# Altium project ProjectX.PrjPcb
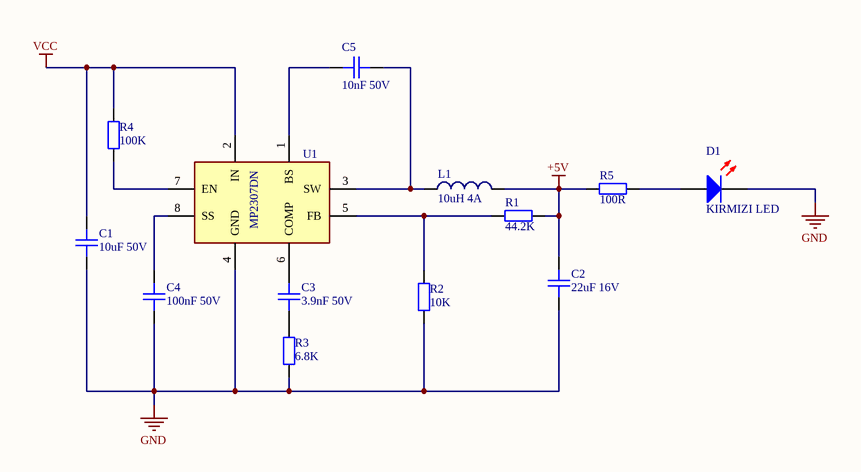
[diagram p0: MP2307DN.SchDoc]
3 sheets, 46 parts. Net scope: global (net labels, ports and power ports of the same name join across sheets).
Sheets:
  MP2307DN.SchDoc
  IR2101.SchDoc
  MCU.SchDoc

## Sheet MP2307DN.SchDoc
size A4

### Parts
C1  Deger: 10uF 50V  [CAP 1206/3216]  (hidden comment: CAP CER 10UF 50V X5R 1206)
C2  Deger: 22uF 16V  [CAP 1206/3216]  (hidden comment: CAP CERAMIC 22UF 16V X7S 20% PAD)
C3  Deger: 3.9nF 50V  [CAP 0805/2012]  (hidden comment: CAP CER 3900PF 50V X7R 0805)
C4  Deger: 100nF 50V  [CAP 0805/2012]  (hidden comment: CAP CER 0.1UF 50V X7R 0805)
C5  Deger: 10nF 50V  [CAP 0805/2012]  (hidden comment: CAP CER 10000PF 50V X7R 0805)
D1  Deger: KIRMIZI LED  [SMD: LED 0805/2012 RED]  (hidden comment: Red 645nm LED Indication - Discrete 1.8V 0805)
L1  FIXED IND 10UH 4A 68 MOHM SMD  [ASPI-0630LR-100M-T15]  (value not drawn)
R1  Deger: 44.2K  [RES_0805]  (hidden comment: RES SMD 44.2K OHM 1% 1/8W 0805)
R2  Deger: 10K  [RES_0805]  (hidden comment: RES SMD 10K OHM 1% 1/8W 0805)
R3  Deger: 6.8K  [RES_0805]  (hidden comment: RES SMD 6.8K OHM 1% 1/8W 0805)
R4  Deger: 100K  [RES_0805]  (hidden comment: RES SMD 100K OHM 1% 1/8W 0805)
R5  Deger: 100R  [RES_0805]  (hidden comment: RES SMD 100 OHM 1% 1/8W 0805)
U1  IC REG BUCK ADJUSTABLE 3A 8SOIC  [SOIC8_PAD]  (value not drawn)

### Nets
+5V: C2.2 L1.2 R1.2 R5.1
GND: C1.1 C2.1 C4.1 D1.2(K) R2.1 R3.1 U1.4(GND)
VCC: C1.2 R4.2 U1.2(IN)
NetC3_1: C3.1 R3.2
NetC3_2: C3.2 U1.6(COMP)
NetC4_2: C4.2 U1.8(SS)
NetC5_1: C5.1 U1.1(BS)
NetC5_2: C5.2 L1.1 U1.3(SW)
NetD1_1: D1.1(A) R5.2
NetR1_1: R1.1 R2.2 U1.5(FB)
NetR4_1: R4.1 U1.7(EN)

### Library data of the parts
C1 = 10uF 50V 1206: 10µF ±10% 50V Ceramic Capacitor X5R 1206 (3216 Metric); Cins: Kondansator; Uretici Kodu: CL31A106KBHNNNE; Kılıf: 1206; -Sicaklik: -55; +Sicaklik: +125; Lehim Yöntemi: SMD; MSL: 1 (Unlimited)
C2 = 22uF 16V 1206: 22µF ±20% 16V Ceramic Capacitor X7S 1206 (3216 Metric); Cins: Kondansator; Uretici Kodu: GRM31CC71C226ME11L; Kılıf: 1206; -Sicaklik: -55; +Sicaklik: +125; Lehim Yöntemi: SMD; MSL: 1 (Unlimited)
C3 = 3.9nF 50V 0805: 3900pF ±10% 50V Ceramic Capacitor X7R 0805 (2012 Metric); Cins: Kondansator; Uretici Kodu: CL21B392KBANNNC; Kılıf: 0805; -Sicaklik: -55; +Sicaklik: +125; Lehim Yöntemi: SMD; MSL: 1 (Unlimited)
C4 = 100nF 50V 0805: 0.1µF ±10% 50V Ceramic Capacitor X7R 0805 (2012 Metric); Kılıf: 0805; Cins: Kondansator; Uretici Kodu: CL21B104KBCNNNC; -Sicaklik: -55; +Sicaklik: +125; Lehim Yöntemi: SMD; MSL: 1 (Unlimited)
C5 = 10nF 50V 0805: 10000pF ±10% 50V Ceramic Capacitor X7R 0805 (2012 Metric); Cins: Kondansator; Uretici Kodu: CL21B103KBANNNC; Kılıf: 0805; -Sicaklik: -55; +Sicaklik: +125; Lehim Yöntemi: SMD; MSL: 1 (Unlimited)
D1 = LED_Kırmızı: LED RED DIFFUSED 0805 SMD; Uretici Kodu: LH R974-LP-1; Kılıf: 0805; -Sicaklik: -40; +Sicaklik: +125; Cins: LED; Lehim Yöntemi: SMD; MSL: 1 (Unlimited)
L1 = 10uH 4A: 10µH Shielded Molded Inductor 4A 68mOhm Max Nonstandard; Cins: Bobin; -Sicaklik: -55; +Sicaklik: +125; Uretici Kodu: ASPI-0630LR-100M-T15; Kılıf: Nonstandard; Lehim Yöntemi: SMD; MSL: 1 (Unlimited); Deger: 10uH 4A
R1 = 44.2K 0805: 44.2 kOhms ±1% 0.125W, 1/8W Chip Resistor 0805 (2012 Metric) Moisture Resistant Thick Film; Cins: Direnc; Uretici Kodu: RC0805FR-0744K2L; Kılıf: 0805; -Sicaklik: -55; +Sicaklik: +155; Lehim Yöntemi: SMD; MSL: 1 (Unlimited)
R2 = 10K 0805: 10 kOhms ±1% 0.125W, 1/8W Chip Resistor 0805 (2012 Metric) Moisture Resistant Thick Film; Cins: Direnc; Kılıf: 0805; Uretici Kodu: RC0805FR-0710KL; -Sicaklik: -55; +Sicaklik: +155; Lehim Yöntemi: SMD; MSL: 1 (Unlimited)
R3 = 6.8K 0805: 6.8 kOhms ±1% 0.125W, 1/8W Chip Resistor 0805 (2012 Metric) Moisture Resistant Thick Film; Cins: Direnc; Kılıf: 0805; Uretici Kodu: RC0805FR-076K8L; -Sicaklik: -55; +Sicaklik: +155; Lehim Yöntemi: SMD; MSL: 1 (Unlimited)
R4 = 100K 0805: 100 kOhms ±1% 0.125W, 1/8W Chip Resistor 0805 (2012 Metric) Moisture Resistant Thick Film; Cins: Direnc; Uretici Kodu: RC0805FR-07100KL; Kılıf: 0805; -Sicaklik: -55; +Sicaklik: +155; Lehim Yöntemi: SMD; MSL: 1 (Unlimited)
R5 = 100R 0805: 100 Ohms ±1% 0.125W, 1/8W Chip Resistor 0805 (2012 Metric) Moisture Resistant Thick Film; Cins: Direnc; Uretici Kodu: RC0805FR-07100RL; Kılıf: 0805; -Sicaklik: -55; +Sicaklik: +155; Lehim Yöntemi: SMD; MSL: 1 (Unlimited)
U1 = MP2307DN: Buck Switching Regulator IC Positive Adjustable 0.925V 1 Output 3A 8-SOIC (0.154", 3.90mm Width) Exposed Pad; Uretici Kodu: MP2307DN-LF-Z; -Sicaklik: -40; +Sicaklik: +85; Lehim Yöntemi: SMD; Cins: IC; Kılıf: 8-SOIC; MSL: 2A (4 Weeks); Deger: MP2307DN

## Sheet IR2101.SchDoc
size A4
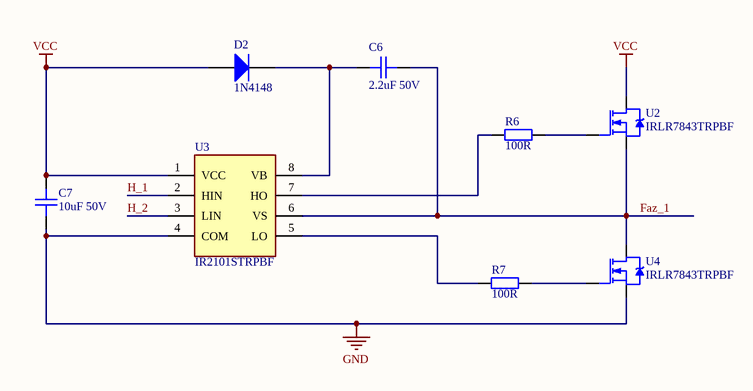
[diagram p1: IR2101.SchDoc]

### Parts
C6  Deger: 2.2uF 50V  [CAP 1206/3216]  (hidden comment: CAP CER 2.2UF 50V X5R 1206)
C7  Deger: 10uF 50V  [CAP 1206/3216]  (hidden comment: CAP CER 10UF 50V X5R 1206)
D2  1N4148 Diyot  [SOD-123]  (value not drawn)
R6  Deger: 100R  [RES_0805]  (hidden comment: RES SMD 100 OHM 1% 1/8W 0805)
R7  Deger: 100R  [RES_0805]  (hidden comment: RES SMD 100 OHM 1% 1/8W 0805)
U2  Deger: IRLR7843TRPBF  [DPAK]  (hidden comment: MOSFET N-CH 30V 161A DPAK)
U3  Deger: IR2101STRPBF  [SOIC8]  (hidden comment: IC GATE DRVR HALF-BRIDGE 8SOIC)
U4  Deger: IRLR7843TRPBF  [DPAK]  (hidden comment: MOSFET N-CH 30V 161A DPAK)

### Nets
GND: C7.1 U3.4(COM) U4.3(S)
VCC: C7.2 D2.1(A) U2.4(D) U3.1(VCC)
Faz_1: C6.1 U2.3(S) U3.6(VS) U4.4(D)
H_1: U3.2(HIN)
H_2: U3.3(LIN)
NetC6_2: C6.2 D2.2(K) U3.8(VB)
NetR6_1: R6.1 U3.7(HO)
NetR6_2: R6.2 U2.1(G)
NetR7_1: R7.1 U3.5(LO)
NetR7_2: R7.2 U4.1(G)

### Library data of the parts
C6 = 2.2uF 50V 1206: 2.2µF ±10% 50V Ceramic Capacitor X5R 1206 (3216 Metric); Cins: Kondansator; Uretici Kodu: CL31A225KBHNNNE; Kılıf: 1206; -Sicaklik: -55; +Sicaklik: +85; Lehim Yöntemi: SMD; MSL: 1 (Unlimited)
C7 = 10uF 50V 1206: as C1 on sheet MP2307DN; MSL: 1 (Unlimited)
D2 = 1N4148: DIODE GEN PURP 100V 150MA SOD123; Uretici Kodu: 1N4148W-TP; -Sicaklik: -65; +Sicaklik: +150; Lehim Yöntemi: SMD; Cins: Diyot; Kılıf: SOD123; MSL: 1 (Unlimited); Deger: 1N4148
R6 R7 = 100R 0805: as R5 on sheet MP2307DN; Lehim Yöntemi: SMD; MSL: 1 (Unlimited)
U2 U4 = IRLR7843: N-Channel 30V 161A (Tc) 140W (Tc) Surface Mount D-Pak; Kılıf: DPAK(TO-252-3); -Sicaklik: -55; +Sicaklik: +175; Lehim Yöntemi: SMD; Cins: MOSFET; Uretici Kodu: IRLR7843TRPBF; MSL: 1 (Unlimited)
U3 = IR2101: Half-Bridge Gate Driver IC Non-Inverting 8-SOIC; -Sicaklik: -40; +Sicaklik: +150; Lehim Yöntemi: SMD; Cins: IC; Uretici Kodu: IR2101STRPBF; Kılıf: 8-SOIC; MSL: 2A (4 Weeks)

## Sheet MCU.SchDoc
size A4
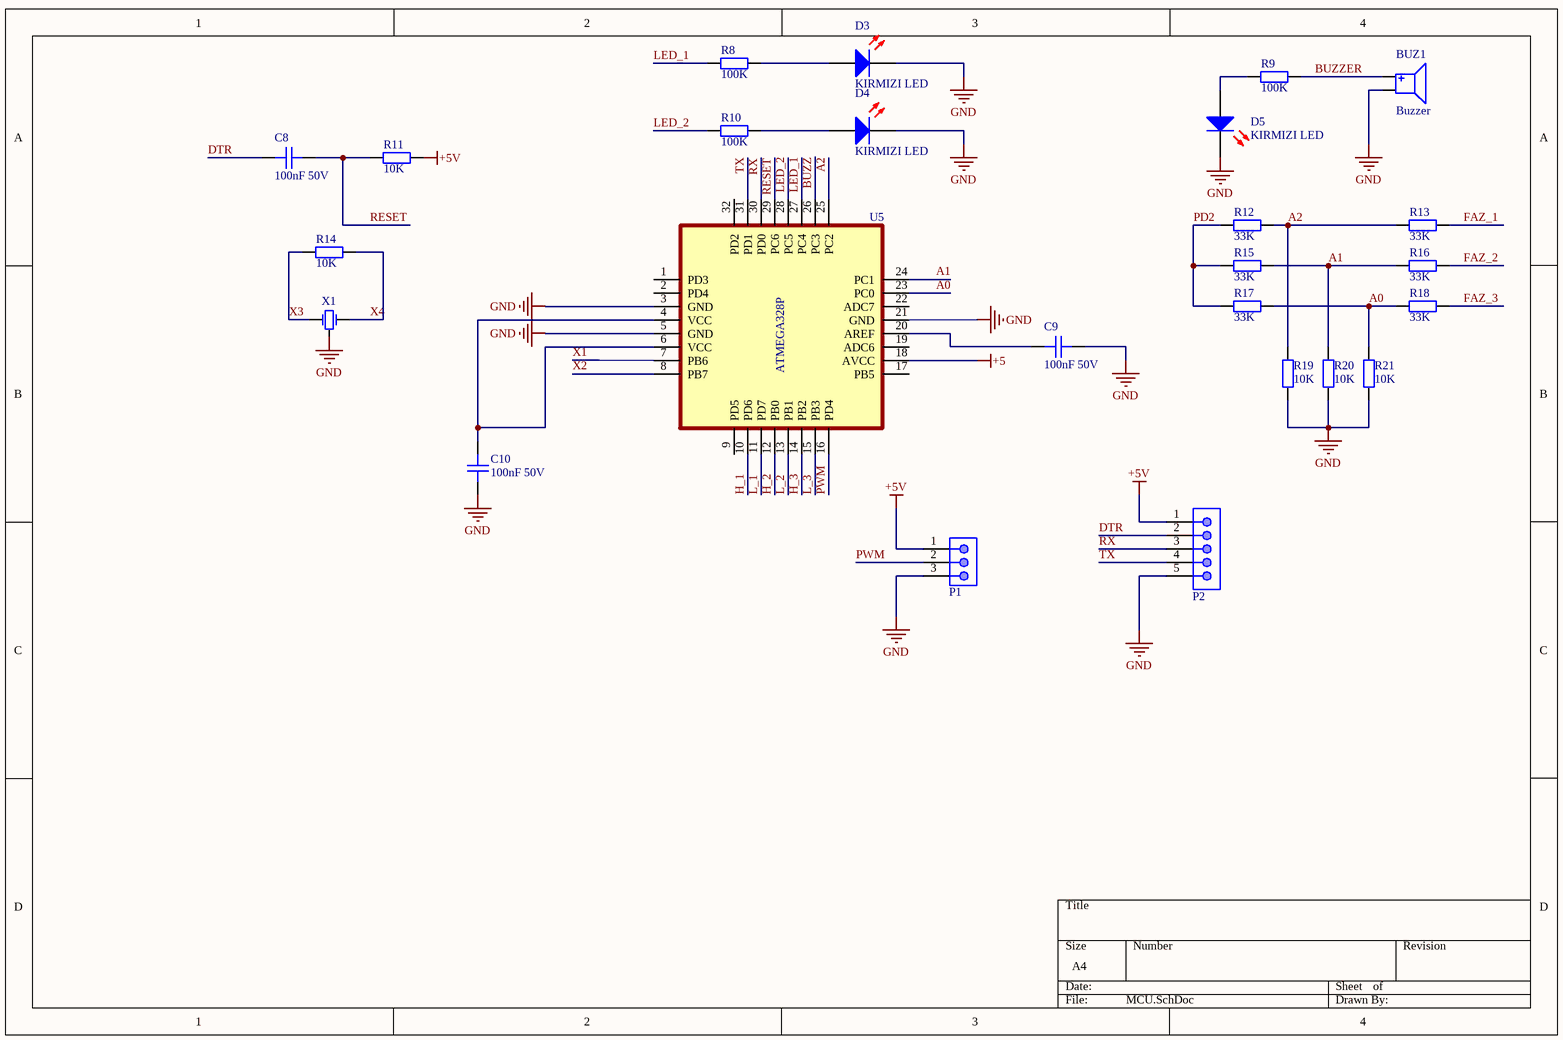
[diagram p2: MCU.SchDoc]

### Parts
BUZ1  Deger: Buzzer  [BUZ: CMT-7525]  (hidden comment: BUZZER MAGN 3.6V 7.5X7.5MM SMD)
C8  Deger: 100nF 50V  [CAP 0805/2012]  (hidden comment: CAP CER 0.1UF 50V X7R 0805)
C9  Deger: 100nF 50V  [CAP 0805/2012]  (hidden comment: CAP CER 0.1UF 50V X7R 0805)
C10  Deger: 100nF 50V  [CAP 0805/2012]  (hidden comment: CAP CER 0.1UF 50V X7R 0805)
D3  Deger: KIRMIZI LED  [SMD: LED 0805/2012 RED]  (hidden comment: Red 645nm LED Indication - Discrete 1.8V 0805)
D4  Deger: KIRMIZI LED  [SMD: LED 0805/2012 RED]  (hidden comment: Red 645nm LED Indication - Discrete 1.8V 0805)
D5  Deger: KIRMIZI LED  [SMD: LED 0805/2012 RED]  (hidden comment: Red 645nm LED Indication - Discrete 1.8V 0805)
P1  WR-PHD 2.54 mm Angled Socket Header  [PWM_CONN]  (value not drawn)
P2  WR-PHD 2.54 mm Angled Socket Header  [TTL_CONN_5]  (value not drawn)
R8  Deger: 100K  [RES_0805]  (hidden comment: RES SMD 100K OHM 1% 1/8W 0805)
R9  Deger: 100K  [RES_0805]  (hidden comment: RES SMD 100K OHM 1% 1/8W 0805)
R10  Deger: 100K  [RES_0805]  (hidden comment: RES SMD 100K OHM 1% 1/8W 0805)
R11  Deger: 10K  [RES_0805]  (hidden comment: RES SMD 10K OHM 1% 1/8W 0805)
R12  Deger: 33K  [RES_0805]  (hidden comment: RES SMD 33K OHM 1% 1/8W 0805)
R13  Deger: 33K  [RES_0805]  (hidden comment: RES SMD 33K OHM 1% 1/8W 0805)
R14  Deger: 10K  [RES_0805]  (hidden comment: RES SMD 10K OHM 1% 1/8W 0805)
R15  Deger: 33K  [RES_0805]  (hidden comment: RES SMD 33K OHM 1% 1/8W 0805)
R16  Deger: 33K  [RES_0805]  (hidden comment: RES SMD 33K OHM 1% 1/8W 0805)
R17  Deger: 33K  [RES_0805]  (hidden comment: RES SMD 33K OHM 1% 1/8W 0805)
R18  Deger: 33K  [RES_0805]  (hidden comment: RES SMD 33K OHM 1% 1/8W 0805)
R19  Deger: 10K  [RES_0805]  (hidden comment: RES SMD 10K OHM 1% 1/8W 0805)
R20  Deger: 10K  [RES_0805]  (hidden comment: RES SMD 10K OHM 1% 1/8W 0805)
R21  Deger: 10K  [RES_0805]  (hidden comment: RES SMD 10K OHM 1% 1/8W 0805)
U5  IC MCU 8BIT 32KB FLASH 32TQFP  [TQFP32]  (value not drawn)
X1  CERAMIC RES 16.0000MHZ 15PF SMD  [CRYSTAL_16MHZ(CTSE16)]  (value not drawn)

### Nets
+5: U5.18(AVCC)
+5V: P1.1 P2.1 R11.2
GND: BUZ1.2(Negative) C9.2 C10.1 D3.2(K) D4.2(K) D5.2(K) P1.3 P2.5 R19.1 R20.1 R21.1 U5.3(GND) U5.5(GND) U5.21(GND) X1.2(GND)
A0: R17.2 R18.1 R21.2 U5.23(PC0)
A1: R15.2 R16.1 R20.2 U5.24(PC1)
A2: R12.2 R13.1 R19.2 U5.25(PC2)
BUZZ: U5.26(PC3)
BUZZER: BUZ1.1(Positive) R9.2
DTR: C8.1 P2.2
Faz_1: R13.2
FAZ_2: R16.2
FAZ_3: R18.2
H_1: U5.10(PD6)
H_2: U5.12(PB0)
H_3: U5.14(PB2)
L_1: U5.11(PD7)
L_2: U5.13(PB1)
L_3: U5.15(PB3)
LED_1: R8.1 U5.27(PC4)
LED_2: R10.1 U5.28(PC5)
PD2: R12.1 R15.1 R17.1
PWM: P1.2 U5.16(PD4)
RESET: C8.2 R11.1 U5.29(PC6)
RX: P2.3 U5.30(PD0)
TX: P2.4 U5.31(PD1)
X1: U5.7(PB6)
X2: U5.8(PB7)
X3: R14.1 X1.1(OSC1)
X4: R14.2 X1.3(OSC2)
NetC9_1: C9.1 U5.20(AREF)
NetC10_2: C10.2 U5.4(VCC) U5.6(VCC)
NetD3_1: D3.1(A) R8.2
NetD4_1: D4.1(A) R10.2
NetD5_1: D5.1(A) R9.1

Not connected (* = marked no-connect by the designer): U5 1(PD3) 2(PD4) 9(PD5) 17(PB5) 19(ADC6) 22(ADC7) 32(PD2)

### Library data of the parts
BUZ1 = Buzzer(CMT-7525-80-SMT-TR): Buzzers Transducer, Externally Driven Magnetic 3.6V 100mA 2.73kHz 80dB @ 3.6V, 10cm Surface Mount Solder Pads; Kılıf: Nonstandard; -Sicaklik: -40; +Sicaklik: +85; Cins: Buzzer; Uretici Kodu: CMT-7525-80-SMT-TR; MSL: 1 (Unlimited); Lehim Yöntemi: SMD
C8-C10 = 100nF 50V 0805: as C4 on sheet MP2307DN; MSL: 1 (Unlimited)
D3-D5 = LED_Kırmızı: as D1 on sheet MP2307DN; Cins: LED; Lehim Yöntemi: SMD; MSL: 1 (Unlimited)
P1 = HDR(1X3): Cins: Konnektor; Uretici Kodu: 613003143121; Kılıf: 3POS 2.54MM; -Sicaklik: -40; +Sicaklik: +105; Lehim Yöntemi: MANUEL; MSL: 1 (Unlimited)
P2 = HDR(1X5): Cins: Konnektor; Uretici Kodu: 613005143121; Kılıf: 5POS 2.54MM; -Sicaklik: -40; +Sicaklik: +105; Lehim Yöntemi: MANUEL; MSL: 1 (Unlimited)
R8-R10 = 100K 0805: as R4 on sheet MP2307DN; Lehim Yöntemi: SMD; MSL: 1 (Unlimited)
R11 R14 R19-R21 = 10K 0805: as R2 on sheet MP2307DN; Lehim Yöntemi: SMD; MSL: 1 (Unlimited)
R12 R13 R15-R18 = 33K 0805: 33 kOhms ±1% 0.125W, 1/8W Chip Resistor 0805 (2012 Metric) Moisture Resistant Thick Film; Cins: Direnc; Kılıf: 0805; -Sicaklik: -55; +Sicaklik: +155; Uretici Kodu: RC0805FR-0733KL; MSL: 1 (Unlimited); Lehim Yöntemi: SMD
U5 = ATMEGA328P: AVR AVR® ATmega Microcontroller IC 8-Bit 20MHz 32KB (16K x 16) FLASH 32-TQFP (7x7); Uretici Kodu: RC0805FR-07100RL; -Sicaklik: -40; +Sicaklik: +85; Lehim Yöntemi: SMD; Cins: IC; Kılıf: 32-TQFP; MSL: 3 (168 Hours); Deger: ATMEGA328P
X1 = CRYSTAL 16.0000MHZ(CSTCE16M0V53-R0): 16MHz Ceramic Resonator Built in Capacitor 15pF ±0.3%  -20°C ~ 80°C Surface Mount; Cins: Kristal; Kılıf: 3-SMD; -Sicaklik: -20; +Sicaklik: +80; Deger: 16 MHZ 15PF; Uretici Kodu: CSTCE16M0V53-R0; Lehim Yöntemi: SMD; MSL: 1 (Unlimited)

## Nets that join several sheets
+5V: MP2307DN (C2.2 L1.2 R1.2 R5.1), MCU (P1.1 P2.1 R11.2)
GND: MP2307DN (7 pins), IR2101 (C7.1 U3.4 U4.3), MCU (15 pins)
VCC: MP2307DN (C1.2 R4.2 U1.2), IR2101 (C7.2 D2.1 U2.4 U3.1)
Faz_1: IR2101 (C6.1 U2.3 U3.6 U4.4), MCU (R13.2)
H_1: IR2101 (U3.2), MCU (U5.10)
H_2: IR2101 (U3.3), MCU (U5.12)